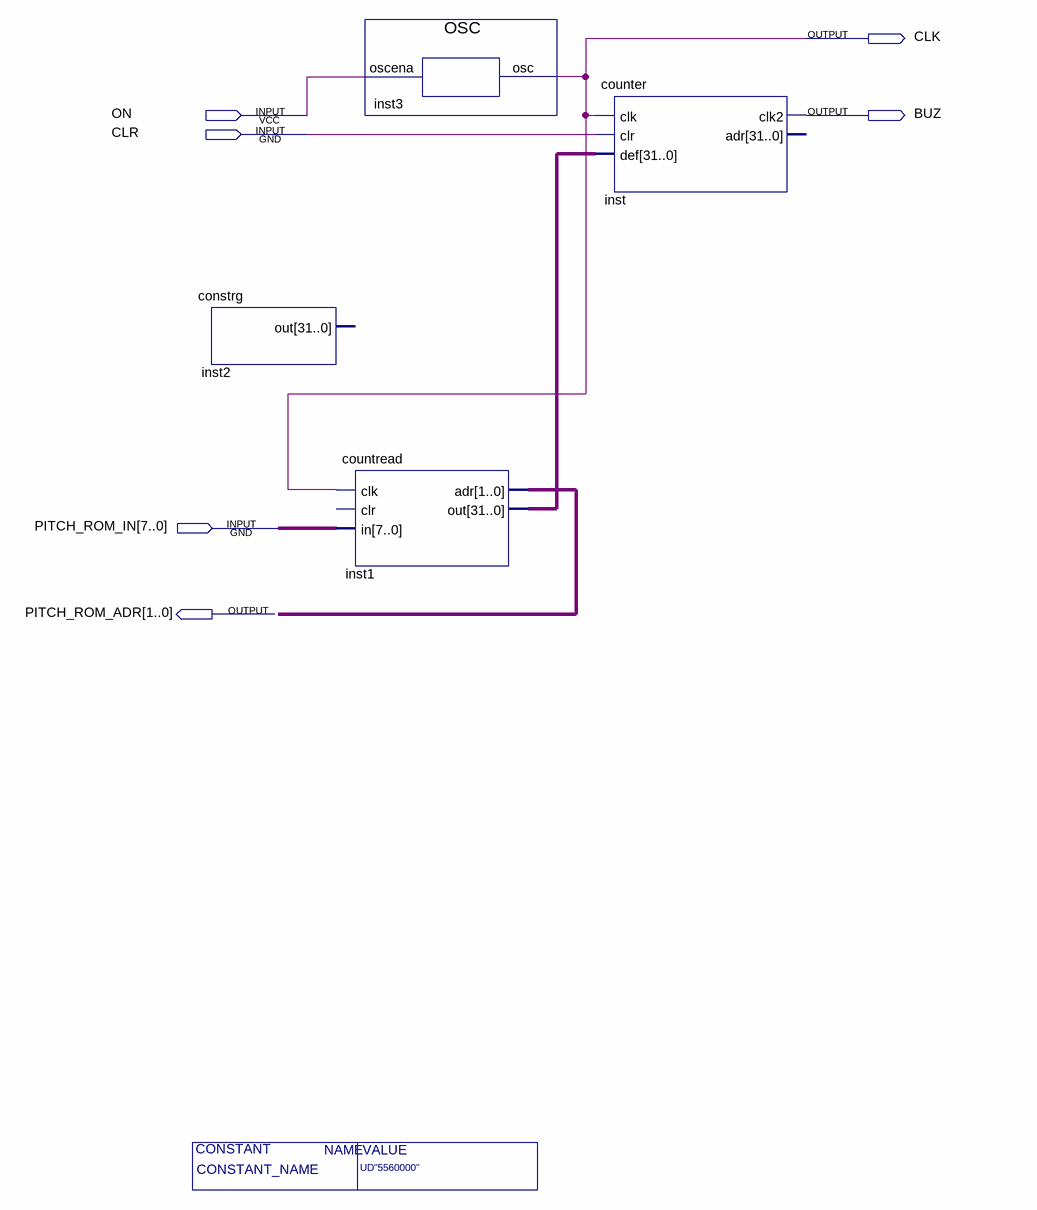
[diagram p0: schematic sheet]
// Quartus schematic LPM32.bdf as structural Verilog: 4 symbols, 6 pins
module LPM32 #(parameter CONSTANT_NAME = "UD\"5560000\"") (
  input  ON,
  input  CLR,
  input  [7:0] PITCH_ROM_IN,
  output CLK,
  output BUZ,
  output [1:0] PITCH_ROM_ADR
);

  wire [31:0] inst1_out;

  constrg inst2 ();  // open: out
  countread inst1 (.clk(CLK), .in(PITCH_ROM_IN), .adr(PITCH_ROM_ADR), .out(inst1_out));  // open: clr
  OSC inst3 (.oscena(ON), .osc(CLK));
  counter inst (.clk(CLK), .clr(CLR), .def(inst1_out), .clk2(BUZ));  // open: adr
endmodule
